# EAGLE design alto-ethernet (EAGLE 7.6.0)
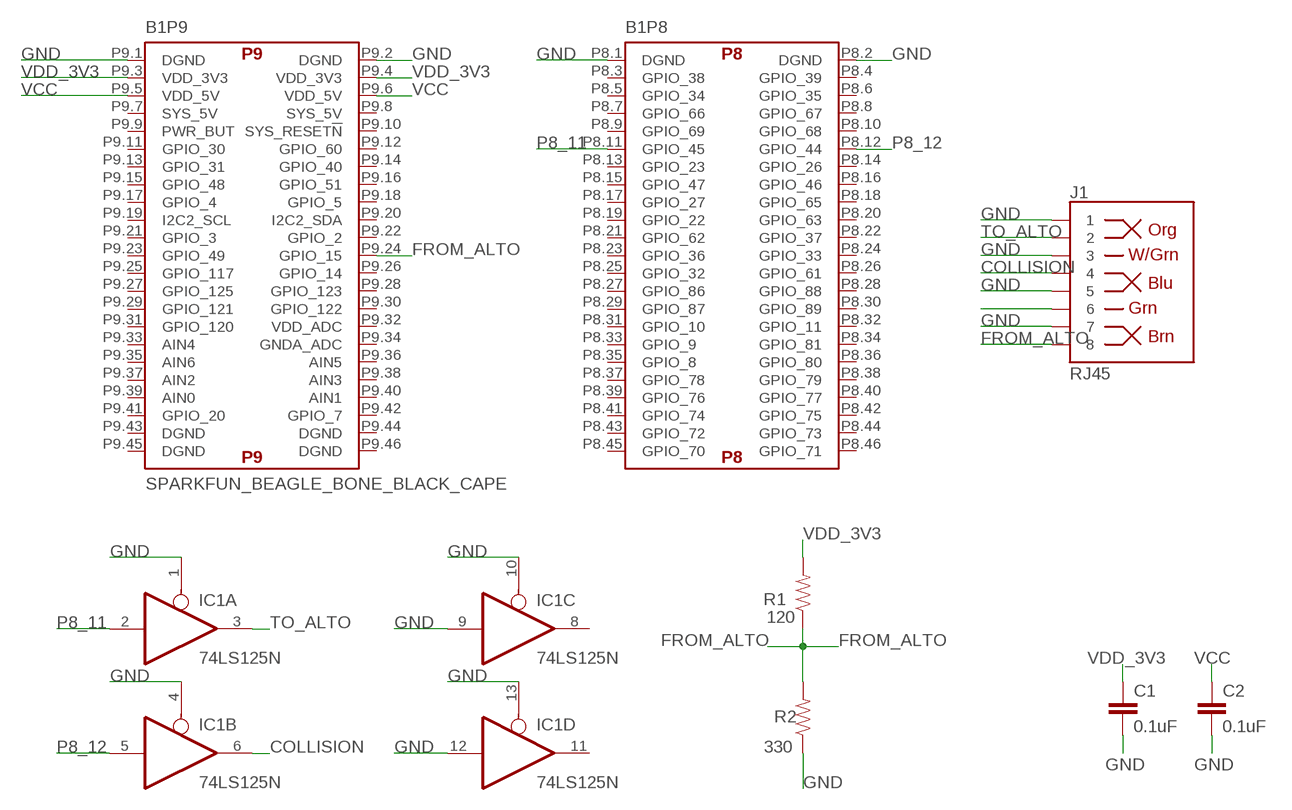
[diagram p0: schematic, sheet 1]

## Parts
B1  SPARKFUN_BEAGLE_BONE_BLACK_CAPE  [BEAGLE_BONE_BLACK_CAPE]
C1  0.1uF  0.1UF-KIT-EZ-50V-20%  [CAP-PTH-SMALL-KIT]
C2  0.1uF  0.1UF-KIT-EZ-50V-20%  [CAP-PTH-SMALL-KIT]
IC1  74LS125N  [DIL14]
J1  RJ45  RJ45-8  [RJ45-8]
R1  120  RESISTORAXIAL-0.3  [AXIAL-0.3]
R2  330  RESISTORAXIAL-0.3  [AXIAL-0.3]

## Nets
COLLISION: IC1.6(B:O) J1.4
FROM_ALTO: B1.P9.24(P9:GPIO_15) J1.8 R1.P$1 R2.P$2
GND: B1.P8.1(P8:DGND) B1.P8.2(P8:DGND) B1.P9.1(P9:DGND) B1.P9.2(P9:DGND) C1.2 C2.2 IC1.1(A:OE) IC1.4(B:OE) IC1.9(C:I) IC1.10(C:OE) IC1.12(D:I) IC1.13(D:OE) J1.1 J1.3 J1.5 J1.7 R2.P$1
N$6: J1.6
P8_11: B1.P8.11(P8:GPIO_45) IC1.2(A:I)
P8_12: B1.P8.12(P8:GPIO_44) IC1.5(B:I)
TO_ALTO: IC1.3(A:O) J1.2
VCC: B1.P9.5(P9:VDD_5V) B1.P9.6(P9:VDD_5V) C2.1
VDD_3V3: B1.P9.3(P9:VDD_3V3) B1.P9.4(P9:VDD_3V3) C1.1 R1.P$2
Unconnected: B1.P8.3(P8:GPIO_38) B1.P8.4(P8:GPIO_39) B1.P8.5(P8:GPIO_34) B1.P8.6(P8:GPIO_35) B1.P8.7(P8:GPIO_66) B1.P8.8(P8:GPIO_67) B1.P8.9(P8:GPIO_69) B1.P8.10(P8:GPIO_68) B1.P8.13(P8:GPIO_23) B1.P8.14(P8:GPIO_26) B1.P8.15(P8:GPIO_47) B1.P8.16(P8:GPIO_46) B1.P8.17(P8:GPIO_27) B1.P8.18(P8:GPIO_65) B1.P8.19(P8:GPIO_22) B1.P8.20(P8:GPIO_63) B1.P8.21(P8:GPIO_62) B1.P8.22(P8:GPIO_37) B1.P8.23(P8:GPIO_36) B1.P8.24(P8:GPIO_33) B1.P8.25(P8:GPIO_32) B1.P8.26(P8:GPIO_61) B1.P8.27(P8:GPIO_86) B1.P8.28(P8:GPIO_88) B1.P8.29(P8:GPIO_87) B1.P8.30(P8:GPIO_89) B1.P8.31(P8:GPIO_10) B1.P8.32(P8:GPIO_11) B1.P8.33(P8:GPIO_9) B1.P8.34(P8:GPIO_81) B1.P8.35(P8:GPIO_8) B1.P8.36(P8:GPIO_80) B1.P8.37(P8:GPIO_78) B1.P8.38(P8:GPIO_79) B1.P8.39(P8:GPIO_76) B1.P8.40(P8:GPIO_77) B1.P8.41(P8:GPIO_74) B1.P8.42(P8:GPIO_75) B1.P8.43(P8:GPIO_72) B1.P8.44(P8:GPIO_73) B1.P8.45(P8:GPIO_70) B1.P8.46(P8:GPIO_71) B1.P9.7(P9:SYS_5V) B1.P9.8(P9:SYS_5V) B1.P9.9(P9:PWR_BUT) B1.P9.10(P9:SYS_RESET!N) B1.P9.11(P9:GPIO_30) B1.P9.12(P9:GPIO_60) B1.P9.13(P9:GPIO_31) B1.P9.14(P9:GPIO_40) B1.P9.15(P9:GPIO_48) B1.P9.16(P9:GPIO_51) B1.P9.17(P9:GPIO_4) B1.P9.18(P9:GPIO_5) B1.P9.19(P9:I2C2_SCL) B1.P9.20(P9:I2C2_SDA) B1.P9.21(P9:GPIO_3) B1.P9.22(P9:GPIO_2) B1.P9.23(P9:GPIO_49) B1.P9.25(P9:GPIO_117) B1.P9.26(P9:GPIO_14) B1.P9.27(P9:GPIO_125) B1.P9.28(P9:GPIO_123) B1.P9.29(P9:GPIO_121) B1.P9.30(P9:GPIO_122) B1.P9.31(P9:GPIO_120) B1.P9.32(P9:VDD_ADC) B1.P9.33(P9:AIN4) B1.P9.34(P9:GNDA_ADC) B1.P9.35(P9:AIN6) B1.P9.36(P9:AIN5) B1.P9.37(P9:AIN2) B1.P9.38(P9:AIN3) B1.P9.39(P9:AIN0) B1.P9.40(P9:AIN1) B1.P9.41(P9:GPIO_20) B1.P9.42(P9:GPIO_7) B1.P9.43(P9:DGND) B1.P9.44(P9:DGND) B1.P9.45(P9:DGND) B1.P9.46(P9:DGND) IC1.8(C:O) IC1.11(D:O)

## Power pins joined to a net without a drawn wire
GND: IC1.7(P:GND)
VCC: IC1.14(P:VCC)

## Library data of the parts
B1 = SparkFun-Boards:SPARKFUN_BEAGLE_BONE_BLACK_CAPE: BeagleBone Black Rev C Cape Generic footprint for BeagleBone Black Rev C Capes. SparkFun Products: SparkFun BeagleBone Black Proto Cape <https://www.sparkfun.com/products/12774> SparkFun CryptoCape <https://www.sparkfun.com/products/12773>
C1 C2 = SparkFun-Capacitors:0.1UF: 0.1µF ceramic capacitors A capacitor is a passive two-terminal electrical component used to store electrical energy temporarily in an electric field.; PROD_ID: CAP-08370
IC1 = adafruit:74*125: Quad bus BUFFER, 3-state
J1 = SparkFun-Connectors:RJ45-8: RJ45 Jack - 8 pin Simple RJ45, 8-pin connection. Commonly used for Cat5, Cat5e, and Cat6 Ethernet cables. Here is the connector we sell at SparkFun: RJ45 8-Pin Connector <https://www.sparkfun.com/products/643> (PRT-00643) Datasheet <https://cdn.sparkfun.com/datasheets/Prototyping/04908.pdf> It is used on this SparkFun product: SparkFun RJ45 Breakout <https://www.sparkfun.com/products/716> (BOB-00716) Note, you may also be interested in the "MAGJACK" version of this. It is basically a RJ45 connector, but also has some status LEDs built into the connector housing. You can check that out in this library at the device named "MAGJACK.dev" and see these products online: RJ45 Ethernet MagJack-Compatible <https://www.sparkfun.com/products/8534> (PRT-08534) SparkFun RJ45 MagJack Breakout <https://www.sparkfun.com/products/13021> (BOB-13021); PROD_ID: CONN-08506; SF_ID: PRT-00643
R1 R2 = SparkFun-Resistors:RESISTOR: Generic Resistor Package

## Board
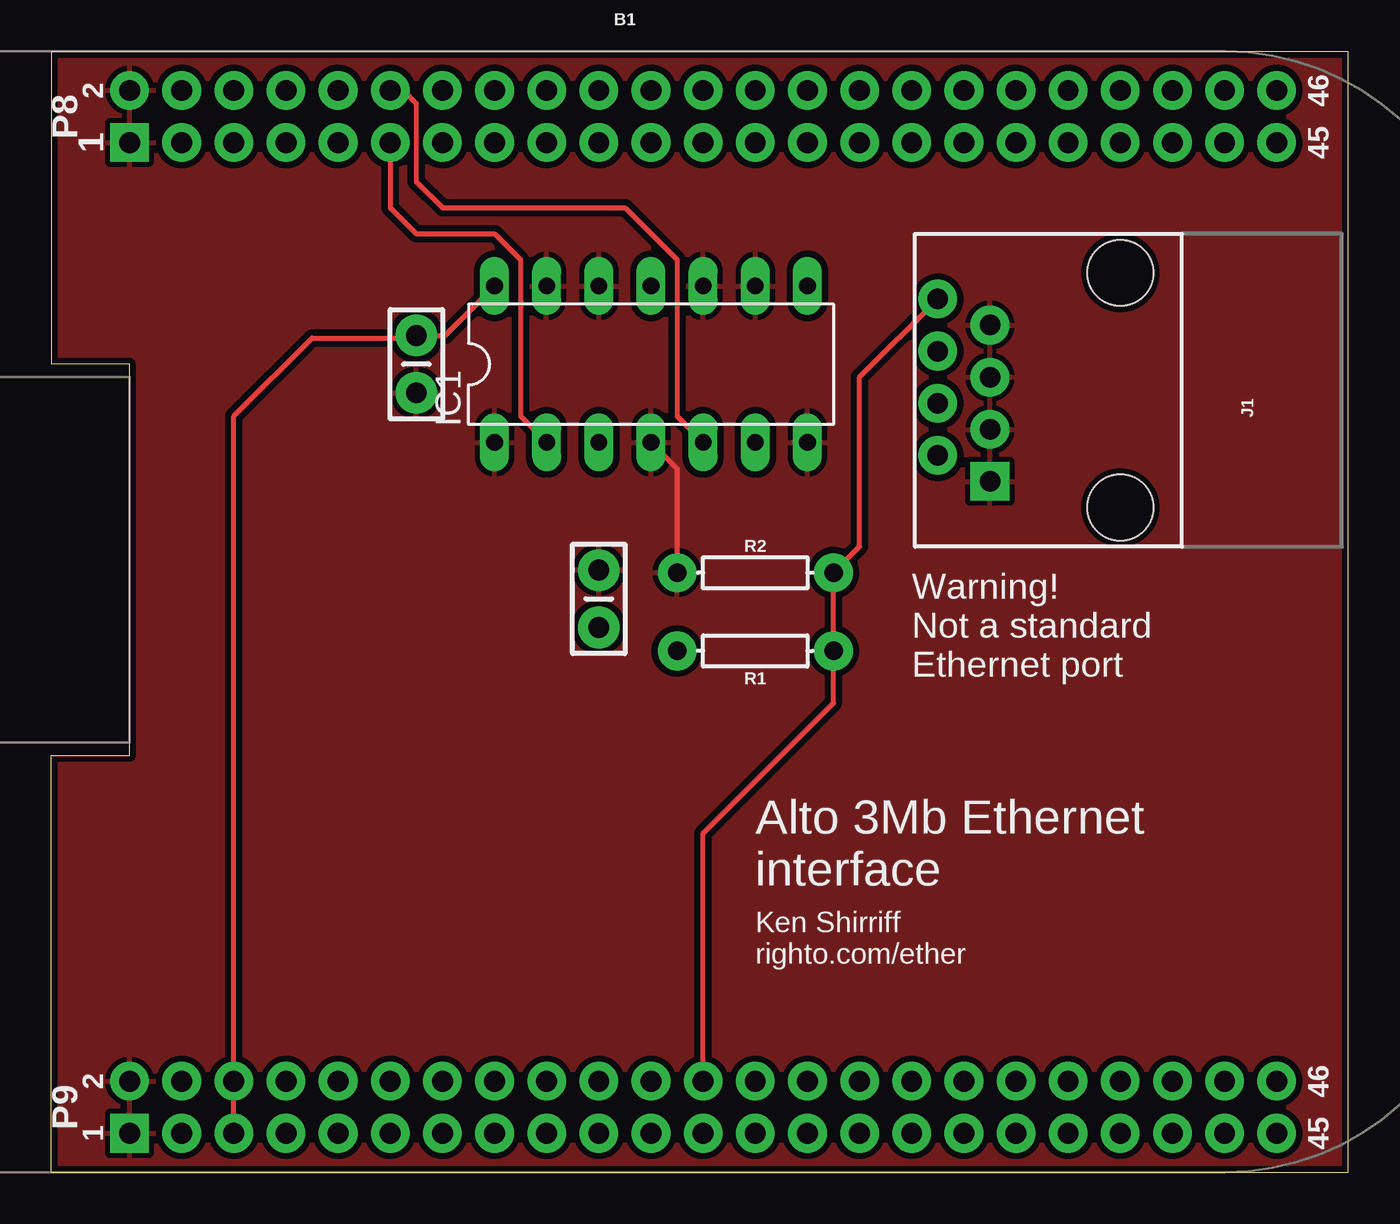
[diagram p1: board, top side]
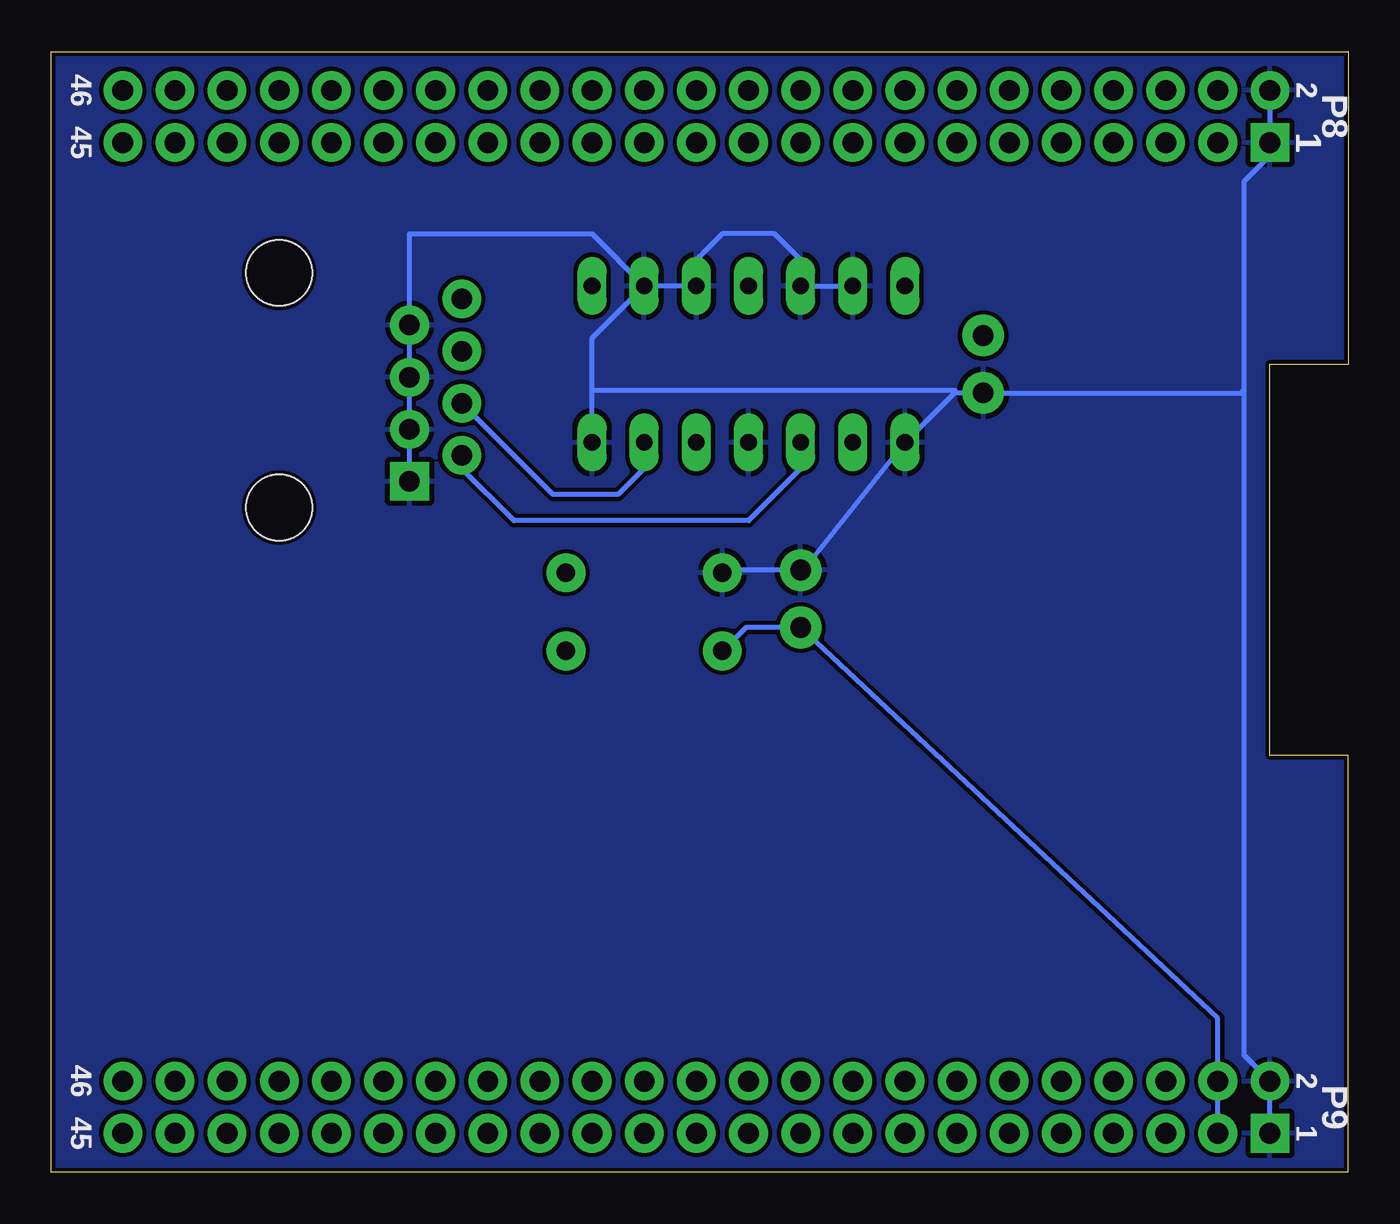
[diagram p2: board, bottom side, seen from below]

Size 63.17 x 54.61 mm. Coordinates in mm from the lower left corner, seen from the top.
Outline: 0,54.6 63.17,54.6 63.17,0 0,0 0,20.32 3.81,20.32 3.81,39.37 0,39.37 0,54.61
Copper layers (1*16): Top 0.035mm / dielectric 1.5mm / Bottom 0.035mm
Design rules "SparkFun": minimum track width 8mil, minimum drill 20mil, track to track 8mil, track to pad 8mil, pad to pad 8mil, via to via 8mil, smd to smd 8mil, copper to edge 8mil, drill to drill 8mil, minimum pad ring 12mil, minimum via ring 10mil, stop-mask expansion 4mil, vias tented up to drill 20mil, thermal gap 10mil

### Footprints (pad centres in the part's own frame; a part is rotated, then mirrored left to right if it is on the bottom)
BEAGLE_BONE_BLACK_CAPE = drill 1.016 pad 1.88 square: P8.1 -24.13,20.955; P9.1 -24.13,-27.305 | drill 1.016 pad 1.88: P8.2 -24.13,23.495; P8.3 -21.59,20.955; P8.4 -21.59,23.495; P8.5 -19.05,20.955; P8.6 -19.05,23.495; P8.7 -16.51,20.955; P8.8 -16.51,23.495; P8.9 -13.97,20.955; P8.10 -13.97,23.495; P8.11 -11.43,20.955; P8.12 -11.43,23.495; P8.13 -8.89,20.955; P8.14 -8.89,23.495; P8.15 -6.35,20.955; P8.16 -6.35,23.495; P8.17 -3.81,20.955; P8.18 -3.81,23.495; P8.19 -1.27,20.955; P8.20 -1.27,23.495; P8.21 1.27,20.955; P8.22 1.27,23.495; P8.23 3.81,20.955; P8.24 3.81,23.495; P8.25 6.35,20.955; P8.26 6.35,23.495; P8.27 8.89,20.955; P8.28 8.89,23.495; P8.29 11.43,20.955; P8.30 11.43,23.495; P8.31 13.97,20.955; P8.32 13.97,23.495; P8.33 16.51,20.955; P8.34 16.51,23.495; P8.35 19.05,20.955; P8.36 19.05,23.495; P8.37 21.59,20.955; P8.38 21.59,23.495; P8.39 24.13,20.955; P8.40 24.13,23.495; P8.41 26.67,20.955; P8.42 26.67,23.495; P8.43 29.21,20.955; P8.44 29.21,23.495; P8.45 31.75,20.955; P8.46 31.75,23.495; P9.2 -24.13,-24.765; P9.3 -21.59,-27.305; P9.4 -21.59,-24.765; P9.5 -19.05,-27.305; P9.6 -19.05,-24.765; P9.7 -16.51,-27.305; P9.8 -16.51,-24.765; P9.9 -13.97,-27.305; P9.10 -13.97,-24.765; P9.11 -11.43,-27.305; P9.12 -11.43,-24.765; P9.13 -8.89,-27.305; P9.14 -8.89,-24.765; P9.15 -6.35,-27.305; P9.16 -6.35,-24.765; P9.17 -3.81,-27.305; P9.18 -3.81,-24.765; P9.19 -1.27,-27.305; P9.20 -1.27,-24.765; P9.21 1.27,-27.305; P9.22 1.27,-24.765; P9.23 3.81,-27.305; P9.24 3.81,-24.765; P9.25 6.35,-27.305; P9.26 6.35,-24.765; P9.27 8.89,-27.305; P9.28 8.89,-24.765; P9.29 11.43,-27.305; P9.30 11.43,-24.765; P9.31 13.97,-27.305; P9.32 13.97,-24.765; P9.33 16.51,-27.305; P9.34 16.51,-24.765; P9.35 19.05,-27.305; P9.36 19.05,-24.765; P9.37 21.59,-27.305; P9.38 21.59,-24.765; P9.39 24.13,-27.305; P9.40 24.13,-24.765; P9.41 26.67,-27.305; P9.42 26.67,-24.765; P9.43 29.21,-27.305; P9.44 29.21,-24.765; P9.45 31.75,-27.305; P9.46 31.75,-24.765
CAP-PTH-SMALL-KIT = drill 1.016 pad 2.032: 1 -1.397,0; 2 1.397,0
DIL14 = drill 0.813 long: 1 -7.62,-3.81; 2 -5.08,-3.81; 3 -2.54,-3.81; 4 0,-3.81; 5 2.54,-3.81; 6 5.08,-3.81; 7 7.62,-3.81; 8 7.62,3.81; 9 5.08,3.81; 10 2.54,3.81; 11 0,3.81; 12 -2.54,3.81; 13 -5.08,3.81; 14 -7.62,3.81
RJ45-8 = drill 1 pad 1.88 square: 1 -4.445,6.35 | drill 1 pad 1.88: 2 -3.175,8.89; 3 -1.905,6.35; 4 -0.635,8.89; 5 0.635,6.35; 6 1.905,8.89; 7 3.175,6.35; 8 4.445,8.89 | hole 3.2: -5.715,0; 5.715,0
AXIAL-0.3 = drill 0.9 pad 1.88: P$1 -3.81,0; P$2 3.81,0

### Placement (x,y rotation side)
B1  27.94,29.21 0 top
C1  26.67,27.94 90 top
C2  17.78,39.37 270 top
IC1  29.21,39.37 0 top
J1  52.07,38.1 90 top
R1  34.29,25.4 180 top
R2  34.29,29.21 0 top

### Tracks (layer width: path | path; a pad name or v marks a point on that pad's centre or on a via)
COLLISION
  Bottom 0.254: IC1.6 34.29,34.29 35.56,33.02 38.73,33.02 J1.4
FROM_ALTO
  Top 0.254: J1.8 39.37,38.73 39.37,30.48 R2.P$2 R1.P$1 38.1,22.86 31.75,16.51 B1.P9.24
GND
  Top 0.254: IC1.4 30.48,34.29 R2.P$1
  Bottom 0.254: B1.P9.1 B1.P9.2 5.08,5.71 5.08,38.1 | B1.P8.2 3.81,52.07 B1.P8.1 3.81,49.53 5.08,48.26 5.08,38.1 | 5.08,38.1 5.21,37.97 C2.2 19.05,37.97 | 19.05,37.97 19.18,37.97 IC1.1 26.54,29.34 C1.2 30.35,29.34 R2.P$1 | IC1.13 IC1.12 26.67,44.45 27.94,45.72 30.48,45.72 31.75,44.45 IC1.10 IC1.9 | IC1.7 36.83,38.1 | 36.83,38.1 19.18,38.1 19.05,37.97 | 36.83,38.1 36.83,40.64 IC1.9 | J1.1 J1.3 J1.5 J1.7 45.72,45.72 36.83,45.72 IC1.9
  pour Bottom: 0,54.61 63.5,54.61 63.5,0 0,0 0,20.32 3.81,20.32 3.81,39.37 0,39.37
  pour Top (isolate 0.305): 0,54.61 63.5,54.61 63.5,0 0,0 0,20.32 3.81,20.32 3.81,39.37 0,39.37
P8_11
  Top 0.254: B1.P8.11 16.51,46.99 17.78,45.72 21.59,45.72 22.86,44.45 22.86,36.83 IC1.2
P8_12
  Top 0.254: B1.P8.12 17.14,52.7 17.78,52.07 17.78,48.26 19.05,46.99 27.94,46.99 30.48,44.45 30.48,36.83 IC1.5
TO_ALTO
  Bottom 0.254: IC1.3 26.67,34.29 29.21,31.75 40.64,31.75 43.18,34.29 J1.2
VCC
  Top 0.254: IC1.14 19.18,40.77 C2.1 17.65,40.64 12.7,40.64 8.89,36.83 B1.P9.6 B1.P9.5
VDD_3V3
  Bottom 0.254: B1.P9.3 B1.P9.4 6.35,7.49 C1.1 29.34,26.54 R1.P$2

### Text on the board
tPlace: Warning! / Not a standard / Ethernet port | Alto 3Mb Ethernet / interface | Ken Shirriff / righto.com/ether